# Altium schematic sheet contactor_single.SchDoc
size A4
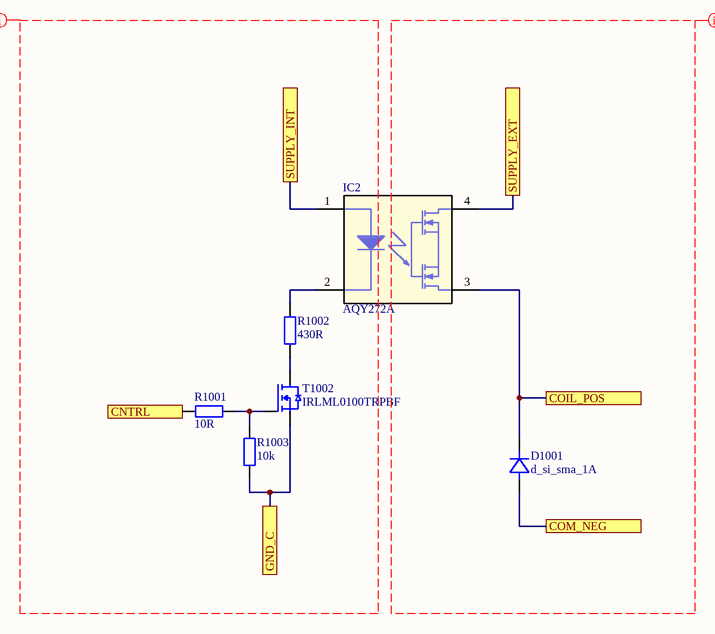
[diagram p0: contactor_single.SchDoc]

## Parts
D1001  d_si_sma_1A  [DIOM4326X24N]
IC2  AQY272A  [AQY27_PDIP_SMD]
R1001  10R  [0603R]
R1002  430R  [0603R]
R1003  10k  [0603R]
T1002  IRLML0100TRPBF  [SOT95P237X110-3N]

## Ports
CNTRL (in), COIL_POS, COM_NEG, GND_C, SUPPLY_EXT, SUPPLY_INT

## Nets
CNTRL: R1001.2 ; port CNTRL
COIL_POS: D1001.1(K) IC2.3 ; port COIL_POS
COM_NEG: D1001.2(A) ; port COM_NEG
GND_C: R1003.1 T1002.S ; port GND_C
SUPPLY_EXT: IC2.4 ; port SUPPLY_EXT
SUPPLY_INT: IC2.1 ; port SUPPLY_INT
NetIC2_2: IC2.2 R1002.2
NetR1001_1: R1001.1 R1003.2 T1002.G
NetR1002_1: R1002.1 T1002.D

## Layout directives
net class ISO_MCU: (no net found under the mark)
net class ISO_EXT: (no net found under the mark)

## Library data of the parts
D1001 = d_si_sma_1A: Standard Recovery Diode, 100 V, 1 A, Single, 1 V, 2 µs, 30 A; Part Name: GF1B; Manufacturer: ON Semiconductor; Breakdown Voltage: 100V; Continuous Forward Current: 1A; Automotive Qualified: False; Part Number: d_si_sma_1A; Operating Temperature: -65°C - +175°C; ComponentLink1Description: Datasheet; ComponentLink1URL: http://www.farnell.com/datasheets/2303965.pdf; Supplier 1: Farnell; Supplier Part Number 1: 1467477
IC2 = AQY272A: PhotoMOS GU 1 Form A, 60 V Load Voltage,2.0 A Continuous Load Current, -40 to 85 degC, 4-Pin DIP(SMT), Tube, RoHS 6A Peak; PartNumber: AQY212GHA; Manufacturer: Panasonic; Pb-Free: True; Load Voltage: 60 V; Continuous Load Current: 1.1 A; On Resistance (Typ): 0.34 Ohm; ComponentLink1Description: Manufacturer URL; ComponentLink2Description: Datasheet; ComponentLink3Description: Package Specification; Series: PhotoMOS GU 1 Form A; ComponentLink3URL: http://www3.panasonic.biz/ac/e_download/control/relay/photomos/catalog/semi_eng_dimensions.pdf?f_cd=401560; DatasheetVersion: 201404-T; ComponentLink1URL: http://www3.panasonic.biz/ac/ae/index.jsp; Mounting Technology: Surface Mount; Packing: Tube; PackageVersion: ASCTB67E, 04/2014; PackageDescription: 4-Pin Surface Mount Terminal Package, Body 4.78 x 6.4 mm, Pitch 2.54mm; ComponentLink2URL: http://www3.panasonic.biz/ac/e_download/control/relay/photomos/catalog/semi_eng_gu1a_aqy21_g.pdf; RoHS: True; PackageReference: DIP4(SMT); Part Number: AQY212GHA
R1001 = gen_R_10R_0603: SMD Resistor 10R 0603; Tolerance: 1%; Power: 0.1W; Case EIA: 0603; Case Metric: 1608; Maximum Working Voltage: 75V; PnP Package: R_0603; Automotive Qualified: False; Part Number: gen_R_10R_0603; Operating Temperature: -55°C - +155°C; Resistance: 10R; Series: E24, E96; PnP Value: 10R; Supplier 1: Farnell; Supplier Part Number 1: 2073361
R1002 = gen_R_430R_0603: SMD Resistor 430R 0603; Tolerance: 1%; Power: 0.1W; Case EIA: 0603; Case Metric: 1608; Maximum Working Voltage: 75V; PnP Package: R_0603; Automotive Qualified: False; Part Number: gen_R_430R_0603; Operating Temperature: -55°C - +155°C; Resistance: 430R; Series: E24; PnP Value: 430R; Supplier 1: Farnell; Supplier Part Number 1: 2074259
R1003 = gen_R_10k_0603: SMD Resistor 10k 0603; Tolerance: 1%; Power: 0.1W; Case EIA: 0603; Case Metric: 1608; Maximum Working Voltage: 75V; PnP Package: R_0603; Automotive Qualified: False; Part Number: gen_R_10k_0603; Operating Temperature: -55°C - +155°C; Resistance: 10k; Series: E24, E96; PnP Value: 10k; Supplier 1: Farnell; Supplier Part Number 1: 2073349
T1002 = IRLML0100TRPBF: MOSFET-Transistor, n-Kanal, 1.6 A, 100 V, 0.178 ohm, 10 V, 2.5 V; Manufacturer: Infineon; Maximum Drain-Source Voltage: 100V; Maximum Continous Drain Current (25°C): 1.6A; R_DS(on): 190m; Total Gate Charge: 2.5nC; Automotive Qualified: False; Part Number: IRLML0100TRPBF; Part Name: NMOS; Operating Temperature: -55°C - +150°C; ComponentLink1Description: Datasheet URL; ComponentLink1URL: http://www.farnell.com/datasheets/491501.pdf; Supplier 1: Farnell; Supplier Part Number 1: 1783928